# Altium schematic sheet ProtectionADC.SchDoc
size 420 x 297 mm; Address1: Address1; Address2: Address2; Address3: Address3; Address4: Address4; DocumentNumber: АБВГ.123456.001 Э3; SheetNumber: 2; SheetTotal: 5; Scale: 1:1; DocumentType: Схема электрическая принципиальная; FirstReferrence: АБВГ.123456.001
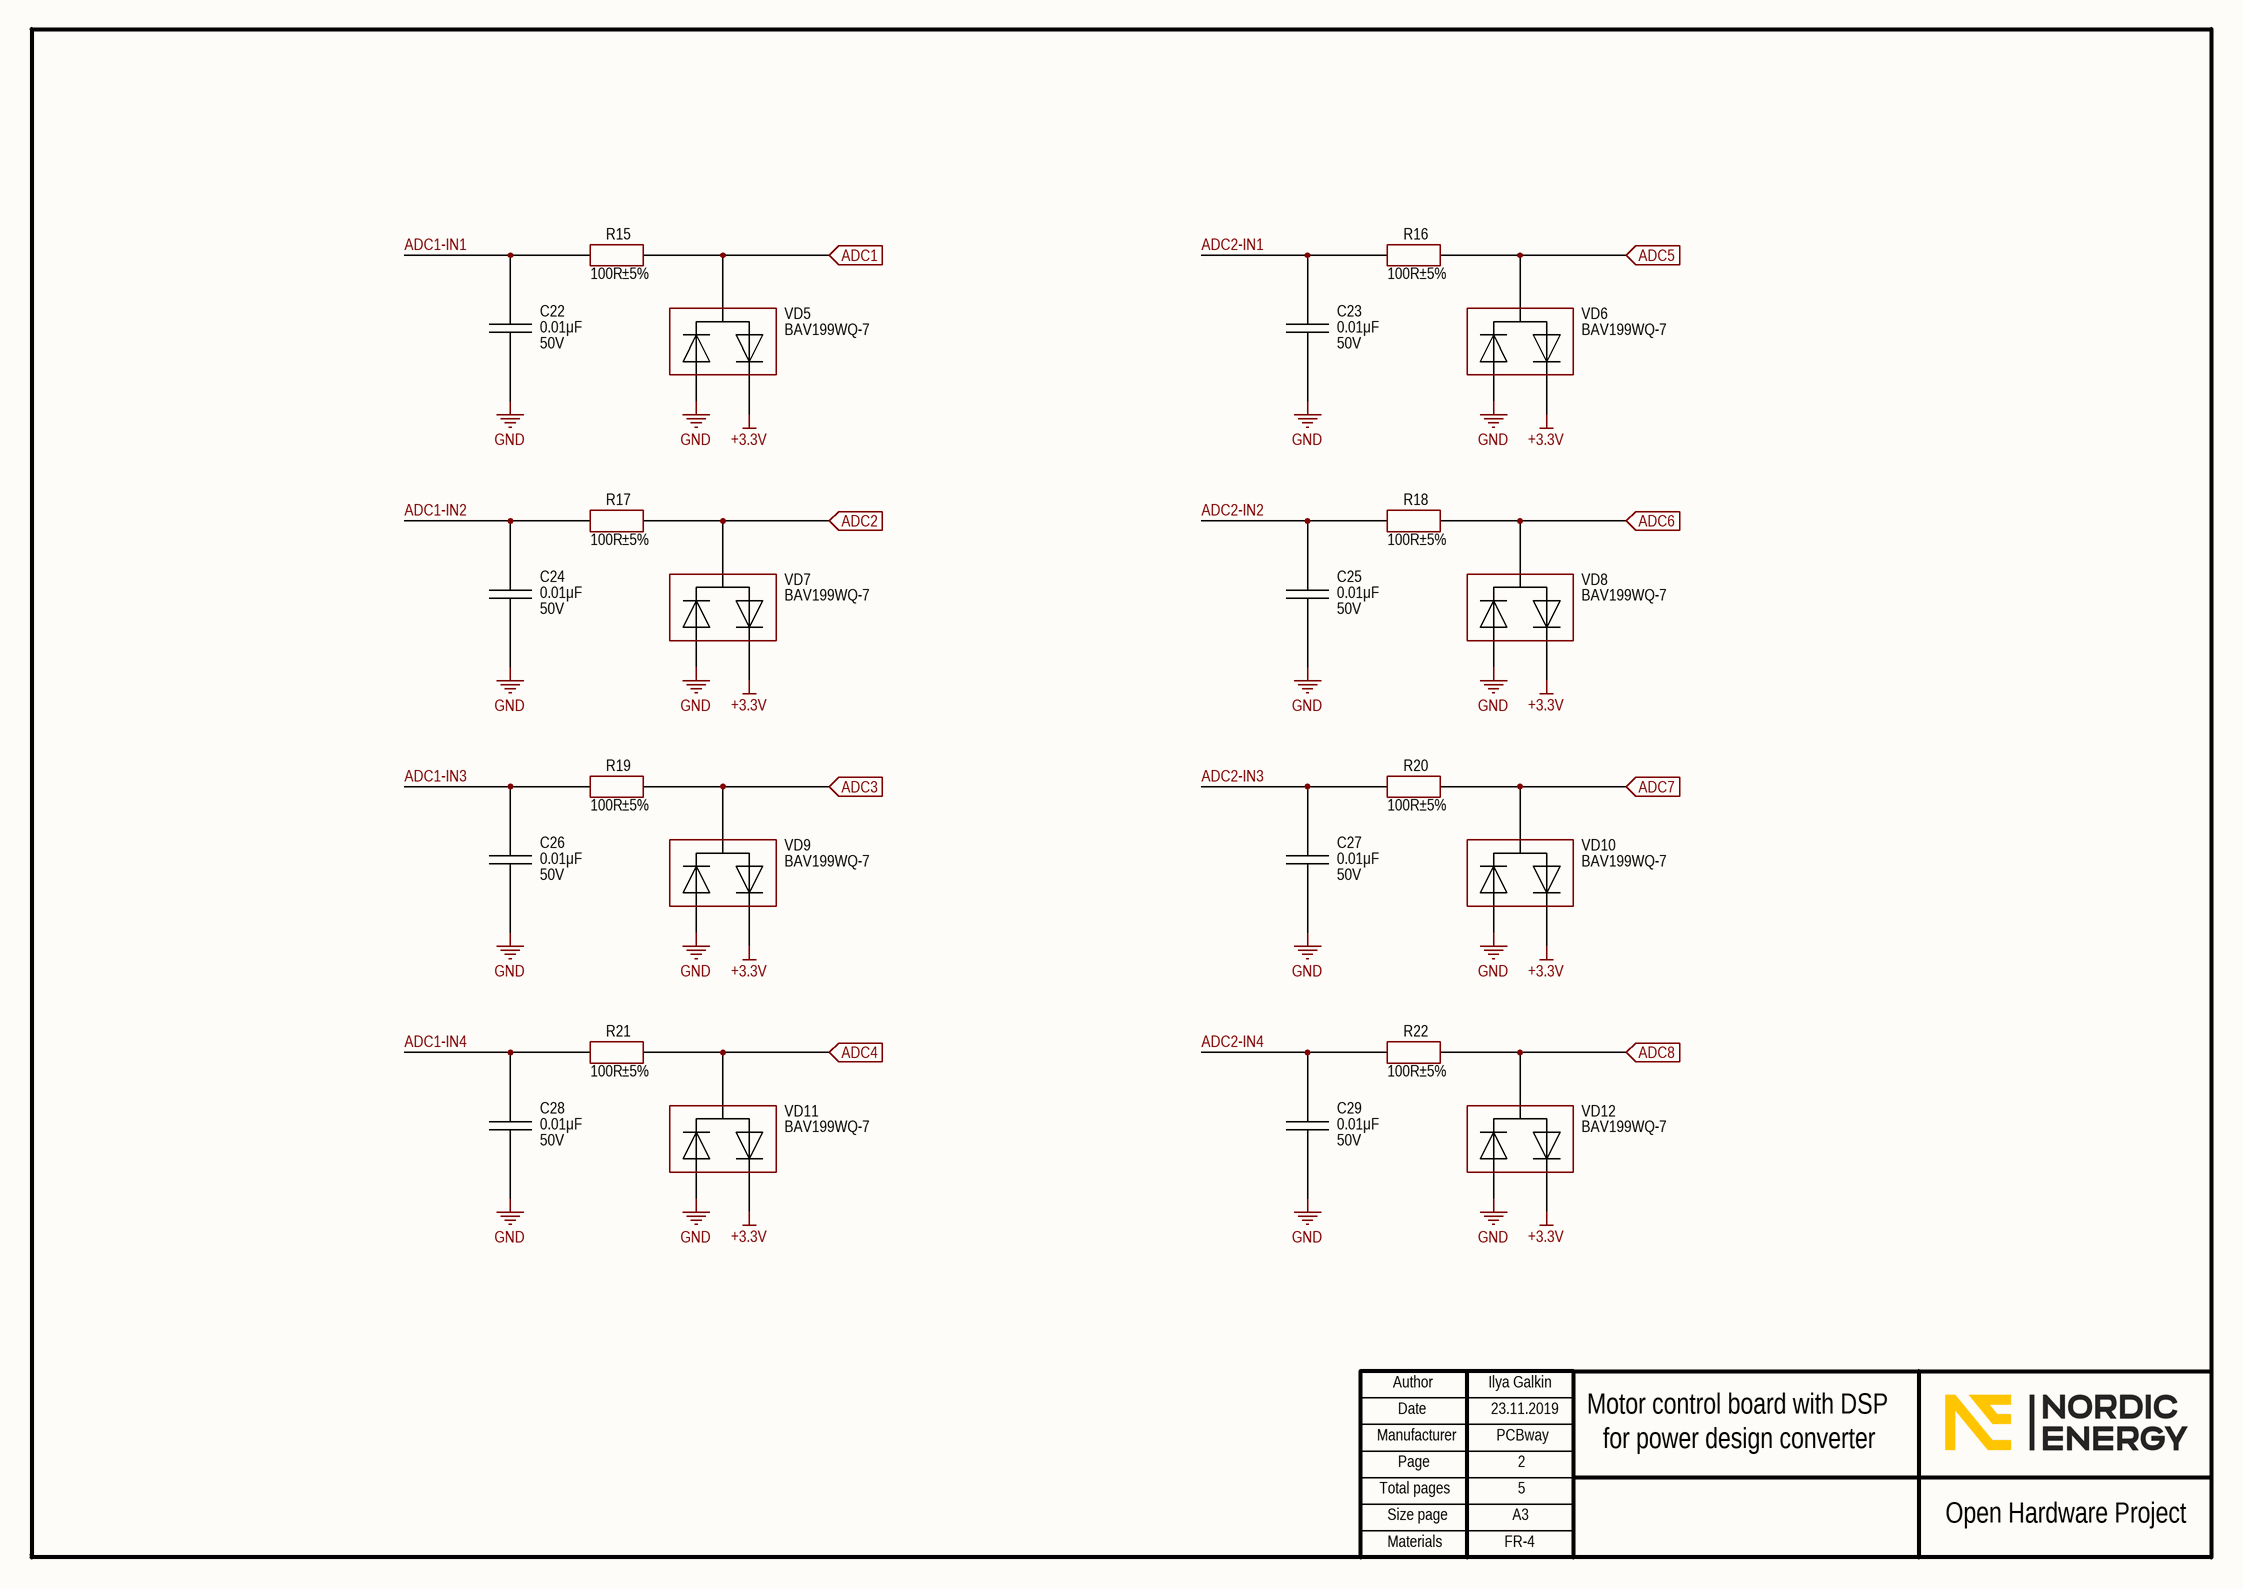
[diagram p0: ProtectionADC.SchDoc]

## Parts
C22  value 0.01μF  Voltage: 50V  [CAP: 0603]
C23  value 0.01μF  Voltage: 50V  [CAP: 0603]
C24  value 0.01μF  Voltage: 50V  [CAP: 0603]
C25  value 0.01μF  Voltage: 50V  [CAP: 0603]
C26  value 0.01μF  Voltage: 50V  [CAP: 0603]
C27  value 0.01μF  Voltage: 50V  [CAP: 0603]
C28  value 0.01μF  Voltage: 50V  [CAP: 0603]
C29  value 0.01μF  Voltage: 50V  [CAP: 0603]
R15  value 100R  Tolerance: ±5%  [RES: 0603]
R16  value 100R  Tolerance: ±5%  [RES: 0603]
R17  value 100R  Tolerance: ±5%  [RES: 0603]
R18  value 100R  Tolerance: ±5%  [RES: 0603]
R19  value 100R  Tolerance: ±5%  [RES: 0603]
R20  value 100R  Tolerance: ±5%  [RES: 0603]
R21  value 100R  Tolerance: ±5%  [RES: 0603]
R22  value 100R  Tolerance: ±5%  [RES: 0603]
VD5  PartNumber: BAV199WQ-7  [SC-70]
VD6  PartNumber: BAV199WQ-7  [SC-70]
VD7  PartNumber: BAV199WQ-7  [SC-70]
VD8  PartNumber: BAV199WQ-7  [SC-70]
VD9  PartNumber: BAV199WQ-7  [SC-70]
VD10  PartNumber: BAV199WQ-7  [SC-70]
VD11  PartNumber: BAV199WQ-7  [SC-70]
VD12  PartNumber: BAV199WQ-7  [SC-70]

## Ports
ADC1 (in), ADC2 (in), ADC3 (in), ADC4 (in), ADC5 (in), ADC6 (in), ADC7 (in), ADC8 (in)

## Nets
+3.3V: VD5.2 VD6.2 VD7.2 VD8.2 VD9.2 VD10.2 VD11.2 VD12.2
GND: C22.1 C23.1 C24.1 C25.1 C26.1 C27.1 C28.1 C29.1 VD5.1 VD6.1 VD7.1 VD8.1 VD9.1 VD10.1 VD11.1 VD12.1
ADC1: R15.2 VD5.3 ; port ADC1
ADC1-IN1: C22.2 R15.1
ADC1-IN2: C24.2 R17.1
ADC1-IN3: C26.2 R19.1
ADC1-IN4: C28.2 R21.1
ADC2: R17.2 VD7.3 ; port ADC2
ADC2-IN1: C23.2 R16.1
ADC2-IN2: C25.2 R18.1
ADC2-IN3: C27.2 R20.1
ADC2-IN4: C29.2 R22.1
ADC3: R19.2 VD9.3 ; port ADC3
ADC4: R21.2 VD11.3 ; port ADC4
ADC5: R16.2 VD6.3 ; port ADC5
ADC6: R18.2 VD8.3 ; port ADC6
ADC7: R20.2 VD10.3 ; port ADC7
ADC8: R22.2 VD12.3 ; port ADC8

## Notes on the sheet
- Ilya Galkin
- 23.11.2019
- PCBway
- 2
- Motor control board with DSP
- for power design converter
- 5
- FR-4
- Author
- Manufacturer
- Date
- Page
- Total pages
- Size page
- A3
- Open Hardware Project
- Materials

## Library data of the parts
C22-C29 = Ceramic_0603: Manufacturer: Samsung; PartNumber: CL10B103KB8NNNC; ValueManufacturerPartNumber: Ceramic capacitor, 0.01μF, X7R, ±10%, 50V, 0603, -55...+125°C; TypeCapacitor: Ceramic capacitor; Tolerance: ±10%; TypeDielectric: X7R; Package: 0603; HelpURL: https://www.digikey.com/product-detail/en/samsung-electro-mechanics/CL10B103KB8NNNC/1276-1009-1-ND/3889095; Temperature: -55...+125°C
R15-R22 = Resistor_0603: Manufacturer: Yageo; PartNumber: RC0603JR-07100RL; ValueManufacturerPartNumber: Resistor film, 100R, ±5%, 0603, 0.1W, -55...+125°C; TypeResistor: Resistor film; Power: 0.1W; Package: 0603; HelpURL: https://www.digikey.com/product-detail/en/yageo/RC0603JR-07100RL/311-100GRCT-ND/729644; Temperature: -55...+125°C
VD5-VD12 = Diode_array: Manufacturer: Diodes Incorporated; ValueManufacturerPartNumber: Diode array, 85V, 140mA, 1.1V, 3us, SC-70, -65...+150°C; TypeDiode: Diode array; Voltage: 85V; Current: 140mA; VoltageDrop: 1.1V; RecoveryTime: 3us; Package: SC-70; HelpURL: https://www.digikey.com/product-detail/en/diodes-incorporated/BAV199WQ-7/BAV199WQ-7DICT-ND/6003950; Temperature: -65...+150°C